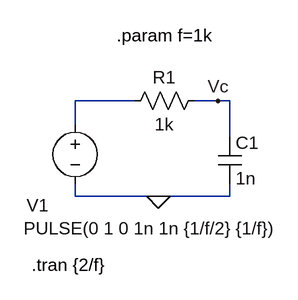
[diagram p0: schematic Analisis Xc.asc]
Analisis Xc.asc, the LTspice schematic file:
Version 4
SHEET 1 880 680
WIRE 112 144 32 144
WIRE 224 144 192 144
WIRE 240 144 224 144
WIRE 32 176 32 144
WIRE 240 192 240 144
WIRE 32 272 32 256
WIRE 144 272 32 272
WIRE 240 272 240 256
WIRE 240 272 144 272
FLAG 144 272 0
FLAG 224 144 Vc
SYMBOL res 208 128 R90
WINDOW 0 0 56 VBottom 2
WINDOW 3 32 56 VTop 2
SYMATTR InstName R1
SYMATTR Value 1k
SYMBOL cap 224 192 R0
SYMATTR InstName C1
SYMATTR Value 1n
SYMBOL voltage 32 160 R0
WINDOW 0 -65 124 Left 2
WINDOW 3 -69 155 Left 2
WINDOW 123 0 0 Left 0
WINDOW 39 0 0 Left 0
SYMATTR InstName V1
SYMATTR Value PULSE(0 1 0 1n 1n {1/f/2} {1/f})
TEXT 88 56 Left 2 !.param f=1k
TEXT -26 364 Left 2 !.tran {2/f}

The netlist it stands for:
* Analisis Xc.asc
R1 Vc N001 1k
C1 Vc 0 1n
V1 N001 0 PULSE(0 1 0 1n 1n {1/f/2} {1/f})
.param f=1k
.tran {2/f}
.backanno
.end